# Altium schematic sheet heater.SchDoc
size A4
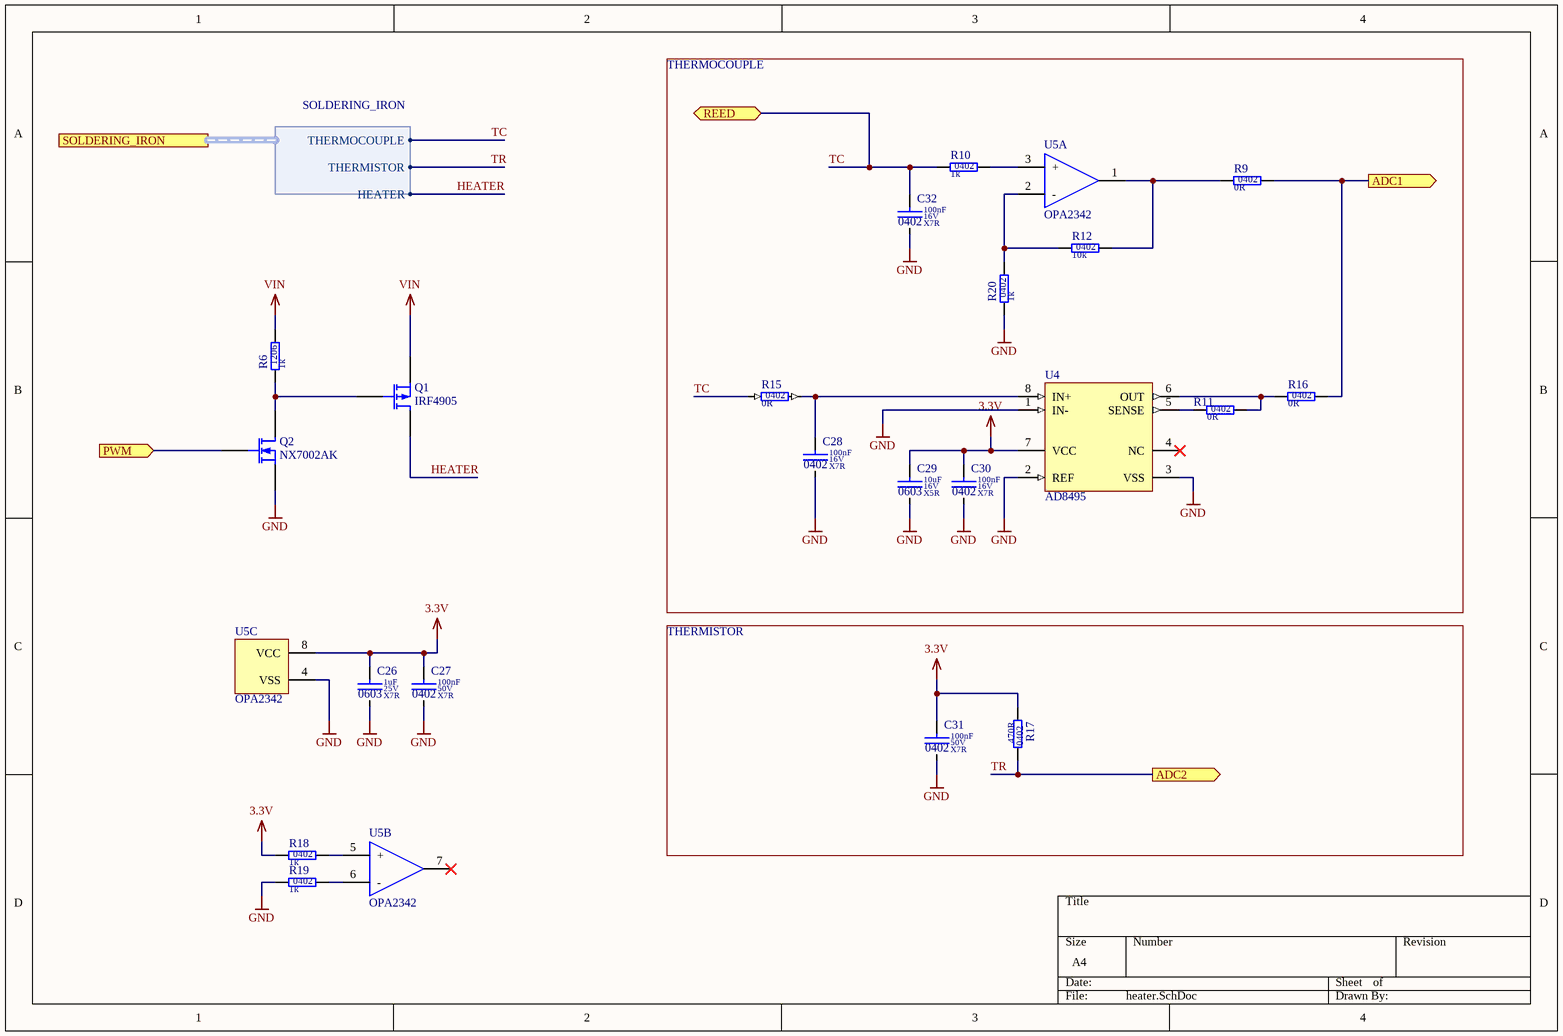
[diagram p0: heater.SchDoc]

## Parts
C26  value 1uF  Dielectric: X7R  Voltage: 25V  SCH_Footprint: 0603  [C_0603_1608]  (hidden comment: Ceramic X7R)
C27  value 100nF  Dielectric: X7R  Voltage: 50V  SCH_Footprint: 0402  [C_0402_1005]  (hidden comment: Ceramic X7R)
C28  value 100nF  Dielectric: X7R  Voltage: 16V  SCH_Footprint: 0402  [C_0402_1005]  (hidden comment: Ceramic X7R)
C29  value 10uF  Dielectric: X5R  Voltage: 16V  SCH_Footprint: 0603  [C_0603_1608]  (hidden comment: Ceramic X5R)
C30  value 100nF  Dielectric: X7R  Voltage: 16V  SCH_Footprint: 0402  [C_0402_1005]  (hidden comment: Ceramic X7R)
C31  value 100nF  Dielectric: X7R  Voltage: 50V  SCH_Footprint: 0402  [C_0402_1005]  (hidden comment: Ceramic X7R)
C32  value 100nF  Dielectric: X7R  Voltage: 16V  SCH_Footprint: 0402  [C_0402_1005]  (hidden comment: Ceramic X7R)
Q1  IRF4905  [IRF4905]
Q2  NX7002AK  [NX7002AK.215]
R6  value 1k  SCH_Footprint: 1206  [R_1206_3216]  (hidden comment: Resistor)
R9  value 0R  SCH_Footprint: 0402  [R_0402_1005]  (hidden comment: Resistor)
R10  value 1k  SCH_Footprint: 0402  [R_0402_1005]  (hidden comment: Resistor)
R11  value 0R  SCH_Footprint: 0402  [R_0402_1005]  (hidden comment: Resistor)
R12  value 10k  SCH_Footprint: 0402  [R_0402_1005]  (hidden comment: Resistor)
R15  value 0R  SCH_Footprint: 0402  [R_0402_1005]  (hidden comment: Resistor)
R16  value 0R  SCH_Footprint: 0402  [R_0402_1005]  (hidden comment: Resistor)
R17  value 470R  SCH_Footprint: 0402  [R_0402_1005]  (hidden comment: Resistor)
R18  value 1k  SCH_Footprint: 0402  [R_0402_1005]  (hidden comment: Resistor)
R19  value 1k  SCH_Footprint: 0402  [R_0402_1005]  (hidden comment: Resistor)
R20  value 1k  SCH_Footprint: 0402  [R_0402_1005]  (hidden comment: Resistor)
U4  AD8495  [AD8494]
U5  OPA2342  [OPA2342]  (parts A,B,C of 3)

## Blocks framed on the sheet
THERMOCOUPLE: C28-C30 C32 R9-R12 R15 R16 R20 U4 U5
THERMISTOR: C31 R17

## Ports
ADC1 (out), ADC2 (out), PWM (in), REED (bidir), SOLDERING_IRON (harness SOLDERING_IRON)

## Harnesses
SOLDERING_IRON: THERMOCOUPLE, THERMISTOR, HEATER

## Nets
3.3V: C26.1 C27.1 C29.1 C30.1 C31.1 R17.1 R18.1 U4.7(VCC) U5.8(VCC)
GND: C26.2 C27.2 C28.2 C29.2 C30.2 C31.2 C32.2 Q2.2(S) R19.1 R20.1 U4.1(IN-) U4.2(REF) U4.3(VSS) U5.4(VSS)
VIN: Q1.3(S) R6.2
ADC1: R9.2 R16.2 ; port ADC1
HEATER: Q1.2(D) ; port SOLDERING_IRON.HEATER
PWM: Q2.1(G) ; port PWM
TC: C32.1 R10.1 R15.1 ; port REED, port SOLDERING_IRON.THERMOCOUPLE
TR: R17.2 ; port ADC2, port SOLDERING_IRON.THERMISTOR
NetC28_1: C28.1 R15.2 U4.8(IN+)
NetQ1_1: Q1.1(G) Q2.3(D) R6.1
NetR9_1: R9.1 R12.2 U5.1(OUT)
NetR10_2: R10.2 U5.3(+)
NetR11_1: R11.1 U4.5(SENSE)
NetR11_2: R11.2 R16.1 U4.6(OUT)
NetR12_1: R12.1 R20.2 U5.2(-)
NetR18_2: R18.2 U5.5(+)
NetR19_2: R19.2 U5.6(-)

Not connected (* = marked no-connect by the designer): U4 4(NC)*; U5 7(OUT)*

## Library data of the parts
C26 = C_1uF_25V_X7R_0603_10: Capacitor; Manufacturer: Samsung; Manufacturer Part Number: CL10B105KA8NNNC; Tolerance (%): 10; Part Number: C_1uF_25V_X7R_0603_10; HelpURL: http://www.tme.eu/pl/Document/4a42202b32dab16128fe107dd69598cc/samsung-chip-cap.pdf; Supplier 1: TME; Supplier Part Number 1: CL10B105KA8NNNC; Supplier 2: RS Components; Supplier 3: Farnell; Supplier 4: Mouser; Supplier 5: Digi-Key
C27 C31 = C_100nF_50V_X7R_0402_10: Capacitor; Manufacturer: Murata; Manufacturer Part Number: GRM155R71H104KE14D; Tolerance (%): 10; Part Number: C_100nF_50V_X7R_0402_10; HelpURL: http://docs-europe.electrocomponents.com/webdocs/145f/0900766b8145f9d2.pdf; Supplier 1: TME; Supplier Part Number 1: GRM155R71H104KE14D; Supplier 2: RS Components; Supplier Part Number 2: 8847087; Supplier 3: Farnell; Supplier Part Number 3: 2611912; Supplier 4: Mouser; Supplier Part Number 4: 81-GRM155R71H104KE4D; Supplier 5: Digi-Key; Supplier Part Number 5: 490-10700-1-ND
C28 C30 C32 = C_100nF_16V_X7R_0402_10: Capacitor; Manufacturer: Murata; Manufacturer Part Number: GRM155R71C104KA88D; Tolerance (%): 10; Part Number: C_100nF_16V_X7R_0402_10; HelpURL: https://www.mouser.com/ds/2/281/c02e-2905.pdf; Supplier 1: TME; Supplier 2: RS Components; Supplier 3: Farnell; Supplier 4: Mouser; Supplier Part Number 4: 81-GRM155R71C104KA88; Supplier 5: Digi-Key
C29 = C_10uF_16V_X5R_0603_20: Capacitor; Manufacturer: Samsung Electro-Mechanics; Manufacturer Part Number: CL10A106MO8NQNC; Tolerance (%): 20; Part Number: C_10uF_16V_X5R_0603_20; HelpURL: http://www.tme.eu/pl/Document/4a42202b32dab16128fe107dd69598cc/samsung-chip-cap.pdf; Supplier 1: TME; Supplier Part Number 1: CL10A106MO8NQNC; Supplier 2: RS Components; Supplier 3: Farnell; Supplier 4: Mouser; Supplier 5: Digi-Key
Q1 = IRF4905: PMOS TO-220
Q2 = NX7002AK.215: Tranzystor: N-MOSFET; unipolarny; 60V; 0,12A; 325mW; SOT23
R6 = R_47k_1206_1: Manufacturer: Royalohm; Manufacturer Part Number: HP06W2F4702T5E; Voltage: 200V; Power: 500mW; Tolerance: 1%; Part Number: R_47k_1206_1; HelpURL: https://www.tme.eu/pl/Document/fa390a0a31e891a154d3713216995c6e/HighPowerHP.pdf; Supplier 1: TME; Supplier Part Number 1: HP06-47K1%; Supplier 2: RS Components; Supplier 3: Farnell; Supplier 4: Mouser; Supplier 5: Digi-Key
R9 R11 R15 R16 = R_0R_0402_5: Manufacturer: Rohm; Manufacturer Part Number: PMR01ZZPJ000; Voltage: 50V; Power: 100mW; Tolerance: 5%; Part Number: R_0R_0402_5; HelpURL: https://pl.mouser.com/datasheet/2/348/pmr-jpw-e-1139188.pdf; Supplier 1: TME; Supplier 2: RS Components; Supplier 3: Farnell; Supplier 4: Mouser; Supplier Part Number 4: 755-PMR01ZZPJ000; Supplier 5: Digi-Key; Supplier Part Number 5: RHM1692-6-ND
R10 R18-R20 = R_1k_0402_1: Manufacturer: Yageo; Manufacturer Part Number: RC0402FR-071K; Voltage: 50V; Power: 63mW; Tolerance: 1%; Part Number: R_1k_0402_1; HelpURL: http://www.tme.eu/pl/Document/1a2bc76e2be68b3b1670068306778ce6/rc0402yageo.pdf; Supplier 1: TME; Supplier Part Number 1: RC0402FR-071K; Supplier 2: RS Components; Supplier 3: Farnell; Supplier Part Number 3: 9239235; Supplier 4: Mouser; Supplier Part Number 4: 603-RC0402FR-071KP; Supplier 5: Digi-Key; Supplier Part Number 5: 311-1.00KLRCT-ND
R12 = R_10k_0402_1: Manufacturer: Yageo; Manufacturer Part Number: RC0402FR-0710KL; Voltage: 50V; Power: 63mW; Tolerance: 1%; Part Number: R_10k_0402_1; HelpURL: http://www.tme.eu/pl/Document/1a2bc76e2be68b3b1670068306778ce6/rc0402yageo.pdf; Supplier 1: TME; Supplier Part Number 1: RC0402FR-0710K; Supplier 2: RS Components; Supplier 3: Farnell; Supplier 4: Mouser; Supplier 5: Digi-Key
R17 = R_470R_0402_1: Manufacturer: Yageo; Manufacturer Part Number: RC0402FR-07470RL; Voltage: 50V; Power: 63mW; Tolerance: 1%; Part Number: R_470R_0402_1; HelpURL: http://datasheet.octopart.com/RC0402FR-07470RL-Yageo-datasheet-10408619.pdf; Supplier 1: TME; Supplier Part Number 1: RC0402FR-07470R; Supplier 2: RS Components; Supplier 3: Farnell; Supplier Part Number 3: 9239197; Supplier 4: Mouser; Supplier Part Number 4: 603-RC0402FR-07470RL; Supplier 5: Digi-Key; Supplier Part Number 5: 311-470LRCT-ND
U4 = AD8495: Precision Thermocouple Amplifiers / with Cold Junction Compensation
U5 = OPA2342: Wzmacniacz operacyjny; 1MHz; 2,7÷5,5V; Kanały: 2; SO8